# EAGLE design finch_pack (EAGLE 9.5.0)
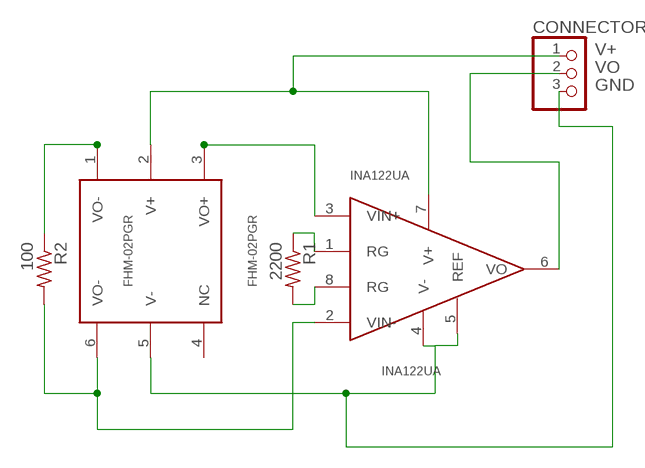
[diagram p0: schematic, sheet 1]

## Parts
CONNECTOR  PINHD-1X3  [1X03]
FHM-02PGR  FHM-02PGR  [FHM-02PGR]
INA122UA  INA122UA  [INA122UA]
R1  2200  R-US_0309/10  [0309/10]
R2  100  R-US_0309/10  [0309/10]

## Nets
GND: CONNECTOR.3 FHM-02PGR.5(V-) INA122UA.4(V-) INA122UA.5(REF)
N$1: FHM-02PGR.3(VO+) INA122UA.3(VIN+)
N$2: FHM-02PGR.6(VO-) INA122UA.2(VIN-) R2.2
N$3: FHM-02PGR.1(VO-) R2.1
N$7: INA122UA.1(RG) R1.1
N$8: INA122UA.8(RG) R1.2
V+: CONNECTOR.1 FHM-02PGR.2(V+) INA122UA.7(V+)
VO: CONNECTOR.2 INA122UA.6(VO)
Unconnected: FHM-02PGR.4(NC)

## Library data of the parts
CONNECTOR = pinhead:PINHD-1X3: PIN HEADER
FHM-02PGR = fujikura-fhm:FHM-02PGR: Fujikura FHM-02PGR Pressure Transducer
INA122UA = texas-ina:INA122UA: Instrumentation Amplifier TI-INA122UA
R1 R2 = rcl:R-US_: RESISTOR, American symbol; SPICEPREFIX: R

## Board
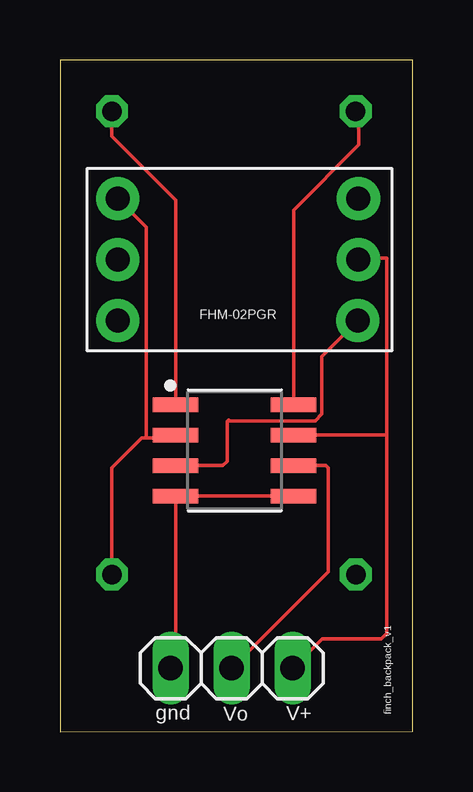
[diagram p1: board, top side]
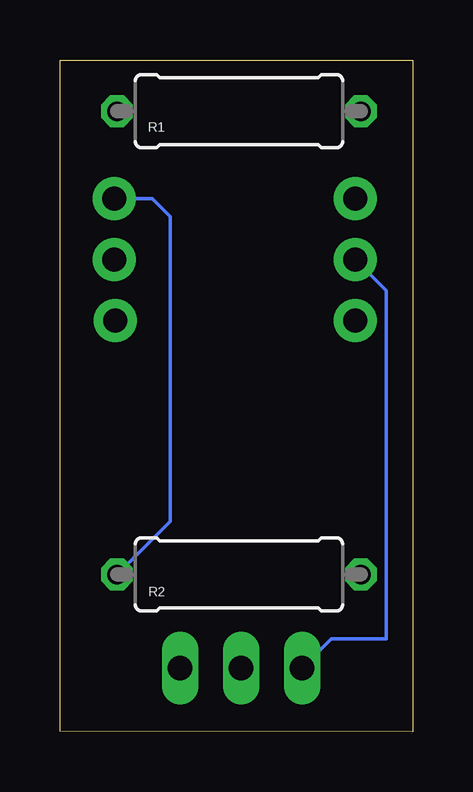
[diagram p2: board, bottom side, seen from below]

Size 14.7 x 28 mm. Coordinates in mm from the lower left corner, seen from the top.
Outline: 0,0 14.7,0.02 14.7,28 0,28 0,0
Copper layers (1*16): Top 0.035mm / dielectric 1.5mm / Bottom 0.035mm
Design rules "default": minimum track width 6mil, minimum drill 0.35mm, track to track 6mil, track to pad 6mil, pad to pad 6mil, via to via 6mil, smd to smd 6mil, copper to edge 40mil, drill to drill 6mil, minimum pad ring 10mil, minimum via ring 8mil, stop-mask expansion 4mil, vias tented up to drill 0mil, thermal gap 10mil

### Footprints (pad centres in the part's own frame; a part is rotated, then mirrored left to right if it is on the bottom)
1X03 = drill 1.016 long: 1 -2.54,0; 2 0,0; 3 2.54,0
FHM-02PGR = drill 1 pad 1.8: 1 4.953,2.54; 2 4.953,0; 3 4.92,-2.54; 4 -5.08,-2.54; 5 -5.08,0; 6 -5.08,2.54
INA122UA = smd 1.901 x 0.599: 1 -2.455,1.905; 2 -2.455,0.635; 3 -2.455,-0.635; 4 -2.455,-1.905; 5 2.455,-1.905; 6 2.455,-0.635; 7 2.455,0.635; 8 2.455,1.905
0309/10 = drill 0.813 octagon: 1 -5.08,0; 2 5.08,0

### Placement (x,y rotation side)
CONNECTOR  7.15,2.64 180 top
FHM-02PGR  7.48,19.67 0 top
INA122UA  7.28,11.72 0 top
R1  7.24,25.86 180 bottom
R2  7.24,6.55 0 bottom

### Tracks (layer width: path | path; a pad name or v marks a point on that pad's centre or on a via)
GND
  Top 0.152: INA122UA.5 INA122UA.4 4.82,2.85 CONNECTOR.3
  Bottom 0.152: CONNECTOR.3 3.39,3.86 1.11,3.86 1.11,18.39 FHM-02PGR.5
N$1
  Top 0.152: INA122UA.3 6.79,11.09 6.96,11.27 6.96,12.92 6.99,12.95 | 6.99,12.95 7.03,12.99 | FHM-02PGR.3 10.91,15.64 10.91,13.23 10.62,12.95 6.99,12.95
N$2
  Top 0.152: FHM-02PGR.6 3.6,21.02 3.6,12.24 3.58,12.23 | 3.58,12.23 4.7,12.23 INA122UA.2 | R2.2 2.16,10.99 3.4,12.23 3.58,12.23
N$3
  Bottom 0.152: R2.1 10.11,8.77 10.11,21.46 10.86,22.21 FHM-02PGR.1
N$7
  Top 0.152: INA122UA.1 4.82,22.16 2.16,24.82 R1.1
N$8
  Top 0.152: INA122UA.8 9.73,21.75 12.45,24.47 12.45,25.73 R1.2
V+
  Top 0.152: 9.74,12.37 INA122UA.7 13.59,12.36 13.61,12.37 | CONNECTOR.1 10.93,3.87 13.38,3.87 13.61,4.1 13.61,12.37 | 13.61,12.37 13.61,19.74 12.5,19.74 FHM-02PGR.2
VO
  Top 0.152: CONNECTOR.2 11.17,6.66 11.17,10.99 11.07,11.09 INA122UA.6

### Text on the board
tPlace: finch_backpack_v1 | gnd | Vo | V+